# Altium schematic sheet LPCB234 - CHARGER IF.SchDoc
size A3; Address1: Factory 10; Address2: 9-13 Dingley Avenue, Dandeong, VICTORIA 3175, AUSTRALIA; DocumentNumber: 6; Revision: 1; SheetNumber: 6; SheetTotal: 10; Lockie__PCB_SUB_ASSEMBLY: Charger Interface; Lockie__PCB_ASSEMBLY: Main; Lockie__LDL: LPCB234; Lockie__PCB_DESCRIPTION: RM4 Power Node
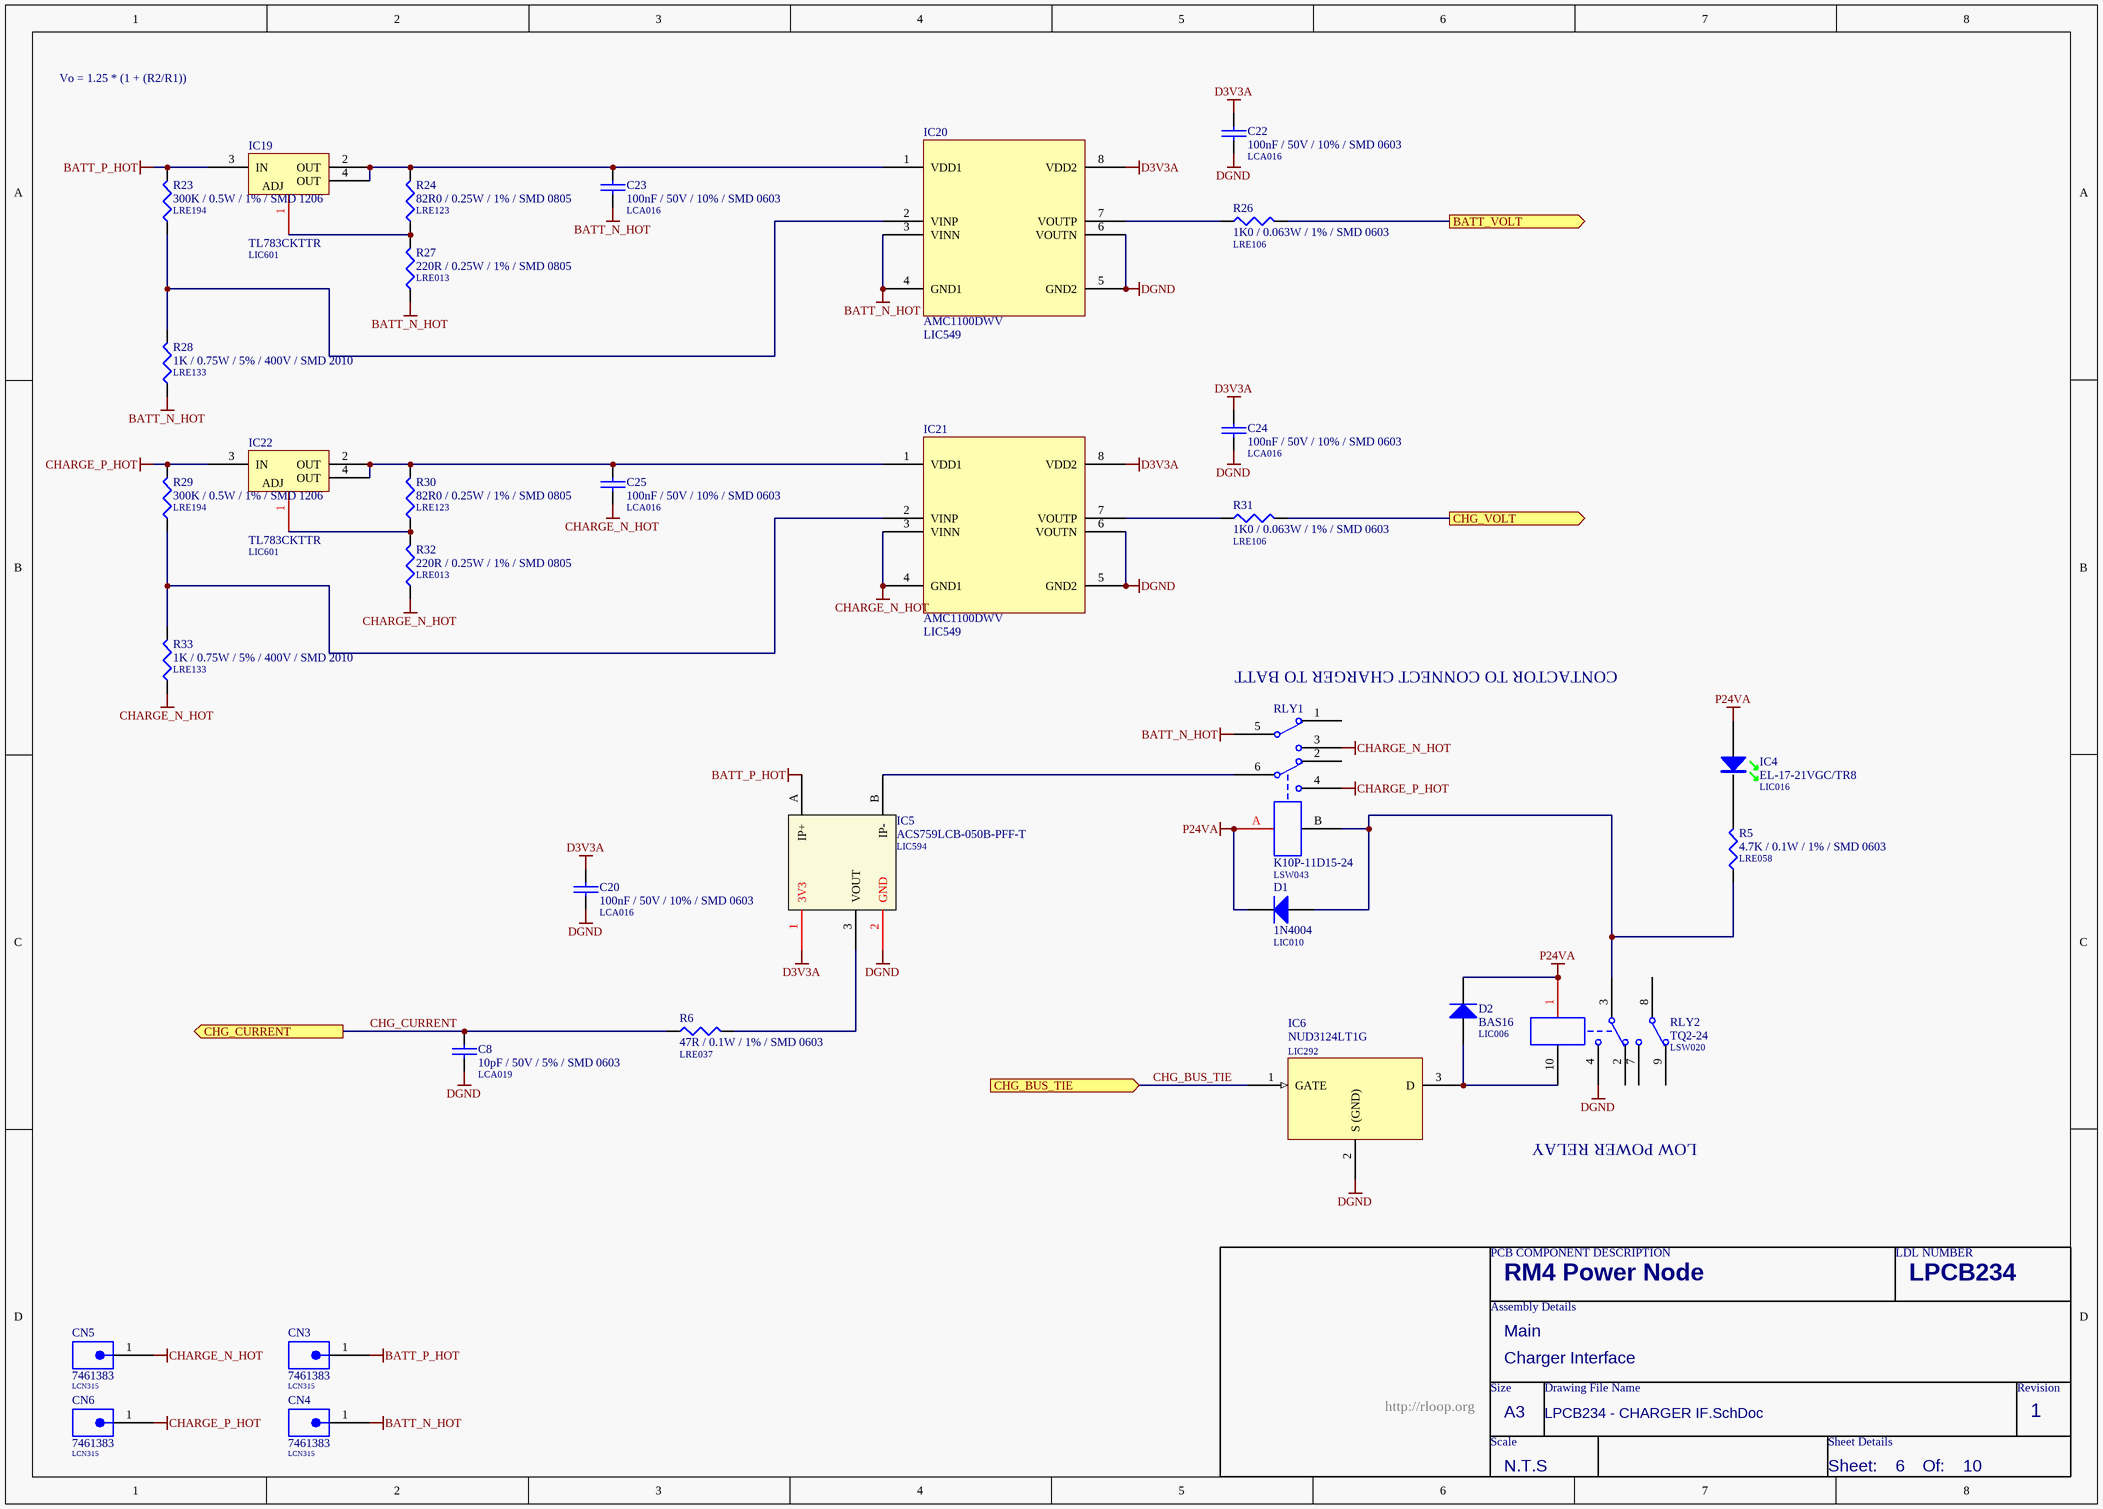
[diagram p0: LPCB234 - CHARGER IF.SchDoc]

## Parts
C8  10pF / 50V / 5% / SMD 0603  LDL_NUMBER: LCA019  [LFP011__CC1608-0603-IPC7351_B]
C20  100nF / 50V / 10% / SMD 0603  LDL_NUMBER: LCA016  [LFP011__CC1608-0603-IPC7351_B]
C22  100nF / 50V / 10% / SMD 0603  LDL_NUMBER: LCA016  [LFP011__CC1608-0603-IPC7351_B]
C23  100nF / 50V / 10% / SMD 0603  LDL_NUMBER: LCA016  [LFP011__CC1608-0603-IPC7351_B]
C24  100nF / 50V / 10% / SMD 0603  LDL_NUMBER: LCA016  [LFP011__CC1608-0603-IPC7351_B]
C25  100nF / 50V / 10% / SMD 0603  LDL_NUMBER: LCA016  [LFP011__CC1608-0603-IPC7351_B]
CN3  7461383  LDL_NUMBER: LCN315  [7461383]
CN4  7461383  LDL_NUMBER: LCN315  [7461383]
CN5  7461383  LDL_NUMBER: LCN315  [7461383]
CN6  7461383  LDL_NUMBER: LCN315  [7461383]
D1  1N4004  LDL_NUMBER: LIC010  [DO-41]
D2  BAS16  LDL_NUMBER: LIC006  [LFP021__SOT23]
IC4  EL-17-21VGC/TR8  LDL_NUMBER: LIC016  [CR2012-0805-LED]
IC5  ACS759LCB-050B-PFF-T  LDL_NUMBER: LIC594  [CB-PFF]
IC6  NUD3124LT1G  LDL_NUMBER: LIC292  [LFP021__SOT23]
IC19  TL783CKTTR  LDL_NUMBER: LIC601  [LFP147__KTT-R-PSFM-G3]
IC20  AMC1100DWV  LDL_NUMBER: LIC549  [LFP116__R-PDSO-G8]
IC21  AMC1100DWV  LDL_NUMBER: LIC549  [LFP116__R-PDSO-G8]
IC22  TL783CKTTR  LDL_NUMBER: LIC601  [LFP147__KTT-R-PSFM-G3]
R5  4.7K / 0.1W / 1% / SMD 0603  LDL_NUMBER: LRE058  [LFP020__CR1608-0603-IPC7351_B]
R6  47R / 0.1W / 1% / SMD 0603  LDL_NUMBER: LRE037  [LFP020__CR1608-0603-IPC7351_B]
R23  300K / 0.5W / 1% / SMD 1206  LDL_NUMBER: LRE194  [LFP107__CR3216-1206]
R24  82R0 / 0.25W / 1% / SMD 0805  LDL_NUMBER: LRE123  [LFP029__CR2012-0805]
R26  1K0 / 0.063W / 1% / SMD 0603  LDL_NUMBER: LRE106  [LFP020__CR1608-0603-IPC7351_B]
R27  220R / 0.25W / 1% / SMD 0805  LDL_NUMBER: LRE013  [LFP029__CR2012-0805]
R28  1K / 0.75W / 5% / 400V / SMD 2010  LDL_NUMBER: LRE133  [LFP060__CR5025-2010]
R29  300K / 0.5W / 1% / SMD 1206  LDL_NUMBER: LRE194  [LFP107__CR3216-1206]
R30  82R0 / 0.25W / 1% / SMD 0805  LDL_NUMBER: LRE123  [LFP029__CR2012-0805]
R31  1K0 / 0.063W / 1% / SMD 0603  LDL_NUMBER: LRE106  [LFP020__CR1608-0603-IPC7351_B]
R32  220R / 0.25W / 1% / SMD 0805  LDL_NUMBER: LRE013  [LFP029__CR2012-0805]
R33  1K / 0.75W / 5% / 400V / SMD 2010  LDL_NUMBER: LRE133  [LFP060__CR5025-2010]
RLY1  K10P-11D15-24  LDL_NUMBER: LSW043  [K10P-11D15-24]
RLY2  TQ2-24  LDL_NUMBER: LSW020  [TQ2]

## Ports
BATT_VOLT (out), CHG_BUS_TIE (in), CHG_CURRENT (out), CHG_VOLT (out)

## Nets
BATT_N_HOT: C23.2 CN4.1 IC20.3(VINN) IC20.4(GND1) R27.1 R28.1 RLY1.5
BATT_P_HOT: CN3.1 IC5.A(IP+) IC19.3(IN) R23.2
CHARGE_N_HOT: C25.2 CN5.1 IC21.3(VINN) IC21.4(GND1) R32.1 R33.1 RLY1.3
CHARGE_P_HOT: CN6.1 IC22.3(IN) R29.2 RLY1.4
D3V3A: C20.1 C22.1 C24.1 IC5.1(3V3) IC20.8(VDD2) IC21.8(VDD2)
DGND: C8.2 C20.2 C22.2 C24.2 IC5.2(GND) IC6.2(S_(GND)) IC20.5(GND2) IC20.6(VOUTN) IC21.5(GND2) IC21.6(VOUTN) RLY2.4
P24VA: D1.K D2.3(K) IC4.A RLY1.A RLY2.1
BATT_VOLT: R26.2 ; port BATT_VOLT
CHG_BUS_TIE: IC6.1(GATE) ; port CHG_BUS_TIE
CHG_CURRENT: C8.1 R6.1 ; port CHG_CURRENT
CHG_VOLT: R31.2 ; port CHG_VOLT
NetC23_1: C23.1 IC19.2(OUT) IC19.4(OUT) IC20.1(VDD1) R24.2
NetC25_1: C25.1 IC21.1(VDD1) IC22.2(OUT) IC22.4(OUT) R30.2
NetD1_A: D1.A R5.1 RLY1.B RLY2.3
NetD2_1: D2.1(A) IC6.3(D) RLY2.10
NetIC4_K: IC4.K R5.2
NetIC5_3: IC5.3(VOUT) R6.2
NetIC5_B: IC5.B(IP-) RLY1.6
NetIC19_1: IC19.1(ADJ) R24.1 R27.2
NetIC20_2: IC20.2(VINP) R23.1 R28.2
NetIC20_7: IC20.7(VOUTP) R26.1
NetIC21_2: IC21.2(VINP) R29.1 R33.2
NetIC21_7: IC21.7(VOUTP) R31.1
NetIC22_1: IC22.1(ADJ) R30.1 R32.2

Not connected (* = marked no-connect by the designer): RLY1 1 2; RLY2 2 7 8 9

## Notes on the sheet
- Vo = 1.25 * (1 + (R2/R1))
- (near RLY1) CONTACTOR TO CONNECT CHARGER TO BATT
- LOW POWER RELAY
- PCB COMPONENT DESCRIPTION
- LDL NUMBER
- Assembly Details
- Size
- Drawing File Name
- Revision
- http://rloop.org
- Scale
- A3
- Sheet Details
- N.T.S
- Sheet:
- Of:

## Library data of the parts
C8 = 10pF / 50V / 5% / SMD 0603: Capacitor, Ceramic Chip, 10pF, 50V, 5%, SMD 0603 [LCA019]; Value: 10p; FMEDA__OPERATING__VOLTAGE_MAX: 3.3; FMEDA__OPERATING__VOLTAGE_MIN: 0; FMEDA__OPERATING__TEMP_MAX: 50; FMEDA__OPERATING__TEMP_MIN: -20; FMEDA__OPERATING__TEMP_TYP: 27; FMEDA__CHANNEL: COM; FMEDA__OPERATING__VOLTAGE_TYP: 3.3; FMEDA__FUNCTION_IN_SYSTEM: *
C20 C22-C25 = 100nF / 50V / 10% / SMD 0603: Capacitor, Ceramic Chip, 100nF (0.1uF), 50V, 5%, SMD 0603 [LCA016]; Value: 100n; FMEDA__OPERATING__VOLTAGE_MIN: 0; FMEDA__OPERATING__VOLTAGE_MAX: 3.3; FMEDA__OPERATING__TEMP_MIN: -20; FMEDA__OPERATING__TEMP_TYP: 27; FMEDA__OPERATING__TEMP_MAX: 50; FMEDA__CHANNEL: COM; FMEDA__FUNCTION_IN_SYSTEM: *; FMEDA__OPERATING__VOLTAGE_TYP: 3.3
CN3-CN6 = 7461383: Terminal, Bush with M5 Shank; FMEDA__CHANNEL: COM; FMEDA__OPERATING__CURRENT_MAX: 0; FMEDA__OPERATING__TEMP_MAX: 50; FMEDA__OPERATING__TEMP_MIN: -20; FMEDA__OPERATING__TEMP_TYP: 27; FMEDA__OPERATING__VOLTAGE_MAX: 16; FMEDA__OPERATING__VOLTAGE_TYP: 12; FMEDA__OPERATING__CURRENT_MIN: 0; FMEDA__OPERATING__CURRENT_TYP: 0; FMEDA__OPERATING__VOLTAGE_MIN: 0
D1 = 1N4004: Diode, General Purpose Rectifier, 1A, PTH [LIC010]; FMEDA__OPERATING__TEMP_MAX: 50; FMEDA__OPERATING__TEMP_MIN: -20; FMEDA__OPERATING__TEMP_TYP: 27; FMEDA__OPERATING__VOLTAGE_MAX: 0; FMEDA__CHANNEL: COM; FMEDA__FUNCTION_IN_SYSTEM: *; FMEDA__OPERATING__VOLTAGE_MIN: 0; FMEDA__OPERATING__VOLTAGE_TYP: 0; FMEDA__OPERATING__CURRENT_MAX: 0; FMEDA__OPERATING__CURRENT_MIN: 0; FMEDA__OPERATING__CURRENT_TYP: 0
D2 = BAS16: Diode, Small Signal, 0.2A, 85V, SMD SOT-23 [LIC006]; FMEDA__OPERATING__CURRENT_MIN: 0; FMEDA__OPERATING__TEMP_MIN: -20; FMEDA__OPERATING__TEMP_TYP: 27; FMEDA__OPERATING__TEMP_MAX: 50; FMEDA__CHANNEL: COM; FMEDA__OPERATING__CURRENT_MAX: 0; FMEDA__OPERATING__VOLTAGE_MIN: 0; FMEDA__OPERATING__VOLTAGE_MAX: 0; FMEDA__FUNCTION_IN_SYSTEM: *; FMEDA__OPERATING__CURRENT_TYP: 0; FMEDA__OPERATING__VOLTAGE_TYP: 0
IC4 = EL-17-21VGC/TR8: LED, SMD, 0805 Green [LIC016]; FMEDA__OPERATING__TEMP_MAX: 50; FMEDA__OPERATING__TEMP_MIN: -20; FMEDA__OPERATING__TEMP_TYP: 27; FMEDA__CHANNEL: COM; FMEDA__FUNCTION_IN_SYSTEM: *
IC5 = ACS759LCB-050B-PFF-T: IC, Hall Effect Current Sensor, PTH; FMEDA__OPERATING__TEMP_MAX: 50; FMEDA__OPERATING__TEMP_MIN: -20; FMEDA__OPERATING__TEMP_TYP: 27; FMEDA__CHANNEL: COM; FMEDA__FUNCTION_IN_SYSTEM: *
IC6 = NUD3124LT1G: IC, Relay Driver, 28V Industrial, SMD SOT23 [LIC292]; FMEDA__OPERATING__TEMP_MIN: -20; FMEDA__OPERATING__TEMP_TYP: 27; FMEDA__OPERATING__TEMP_MAX: 50; FMEDA__OPERATING__VOLTAGE_MIN: 0; FMEDA__OPERATING__VOLTAGE_TYP: 13; FMEDA__OPERATING__VOLTAGE_MAX: 18; FMEDA__OPERATING__POWER_TYP: 0.1; FMEDA__OPERATING__POWER_MAX: 0.15; FMEDA__CHANNEL: COM; FMEDA__FUNCTION_IN_SYSTEM: *; FMEDA__OPERATING__POWER_MIN: 0
IC19 IC22 = TL783CKTTR: IC, High Volt LDO, 0.7A [LIC601]; FMEDA__OPERATING__OUTPUT_CURRENT_MIN: 0; FMEDA__OPERATING__TEMP_MAX: 50; FMEDA__OPERATING__TEMP_MIN: -20; FMEDA__OPERATING__TEMP_TYP: 27; VALUE: 0; Note: Obey Thermal Design Rules; FMEDA__CHANNEL: COM; FMEDA__OPERATING__OUTPUT_CURRENT_TYP: 0; FMEDA__OPERATING__VOLTAGE_MAX: 0; FMEDA__OPERATING__VOLTAGE_MIN: 0; FMEDA__OPERATING__VOLTAGE_TYP: 0; FMEDA__FUNCTION_IN_SYSTEM: *
IC20 IC21 = AMC1100DWV: IC, Isolation Amplifier, SMD SOIC8 [LIC549]
R5 = 4.7K / 0.1W / 1% / SMD 0603: Resistor, Ceramic Chip, 4K7, 0.1W, 1%, SMD 0603 [LRE058]; FMEDA__OPERATING__POWER_MAX: 0; FMEDA__OPERATING__TEMP_MAX: 50; FMEDA__OPERATING__TEMP_MIN: -20; FMEDA__OPERATING__TEMP_TYP: 27; FMEDA__CHANNEL: COM; VALUE: 4.7K; FMEDA__OPERATING__POWER_MIN: 0; FMEDA__OPERATING__VOLTAGE_MAX: 0; FMEDA__OPERATING__VOLTAGE_MIN: 0; FMEDA__OPERATING__VOLTAGE_TYP: 0; FMEDA__FUNCTION_IN_SYSTEM: *
R6 = 47R / 0.1W / 1% / SMD 0603: Resistor, Ceramic Chip, 47R, 0.1W, 1%, SMD 0603 [LRE037]; VALUE: 47; FMEDA__OPERATING__POWER_MAX: 0; FMEDA__OPERATING__TEMP_MAX: 50; FMEDA__OPERATING__TEMP_MIN: -20; FMEDA__OPERATING__TEMP_TYP: 27; FMEDA__CHANNEL: COM; FMEDA__OPERATING__POWER_MIN: 0; FMEDA__OPERATING__VOLTAGE_MAX: 0; FMEDA__OPERATING__VOLTAGE_MIN: 0; FMEDA__OPERATING__VOLTAGE_TYP: 0; FMEDA__FUNCTION_IN_SYSTEM: *
R23 R29 = 300K / 0.5W / 1% / SMD 1206: Resistor, Thick Film, 300K, 0.500W, 200V, 1%, SMD 1206 [LRE194]; FMEDA__OPERATING__POWER_MAX: 0.5; FMEDA__OPERATING__POWER_MIN: 0; FMEDA__OPERATING__VOLTAGE_MAX: 200; FMEDA__OPERATING__TEMP_MAX: 155; FMEDA__OPERATING__TEMP_MIN: -55; FMEDA__OPERATING__TEMP_TYP: 27; FMEDA__CHANNEL: COM; VALUE: 300K; FMEDA__OPERATING__VOLTAGE_MIN: 0; FMEDA__OPERATING__VOLTAGE_TYP: 200; FMEDA__FUNCTION_IN_SYSTEM: *
R24 R30 = 82R0 / 0.25W / 1% / SMD 0805: Resistor, Ceramic Chip, 82R, 0.063W, 1%, SMD 0805 [LRE123]; Value: 82; FMEDA__OPERATING__POWER_MAX: 0; FMEDA__OPERATING__TEMP_MAX: 50; FMEDA__OPERATING__TEMP_MIN: -20; FMEDA__OPERATING__TEMP_TYP: 27; FMEDA__CHANNEL: COM; FMEDA__OPERATING__POWER_MIN: 0; FMEDA__OPERATING__VOLTAGE_MAX: 0; FMEDA__OPERATING__VOLTAGE_MIN: 0; FMEDA__OPERATING__VOLTAGE_TYP: 0
R26 R31 = 1K0 / 0.063W / 1% / SMD 0603: Resistor, Ceramic Chip, 1K0, 0.063W, 1%, SMD 0603 [LRE106]; Value: 1K; FMEDA__OPERATING__POWER_MAX: 0; FMEDA__OPERATING__TEMP_MAX: 50; FMEDA__OPERATING__TEMP_MIN: -20; FMEDA__OPERATING__TEMP_TYP: 27; FMEDA__CHANNEL: COM; FMEDA__OPERATING__POWER_MIN: 0; FMEDA__OPERATING__VOLTAGE_MAX: 0; FMEDA__OPERATING__VOLTAGE_MIN: 0; FMEDA__OPERATING__VOLTAGE_TYP: 0; FMEDA__FUNCTION_IN_SYSTEM: *
R27 R32 = 220R / 0.25W / 1% / SMD 0805: Resistor, Ceramic Chip, 220R, 0.25W, 1%, SMD 0805 [LRE013]; Value: 220; FMEDA__OPERATING__POWER_MAX: 0; FMEDA__OPERATING__TEMP_MAX: 50; FMEDA__OPERATING__TEMP_MIN: -20; FMEDA__OPERATING__TEMP_TYP: 27; FMEDA__CHANNEL: COM; FMEDA__OPERATING__POWER_MIN: 0; FMEDA__OPERATING__VOLTAGE_MAX: 0; FMEDA__OPERATING__VOLTAGE_MIN: 0; FMEDA__OPERATING__VOLTAGE_TYP: 0; FMEDA__FUNCTION_IN_SYSTEM: *
R28 R33 = 1K / 0.75W / 5% / 400V / SMD 2010: Resistor, Thick Film, 1K, 0.75W, 5%, 400V, SMD 2010 [LRE133]; FMEDA__OPERATING__POWER_MAX: 0; FMEDA__OPERATING__TEMP_MAX: 50; FMEDA__OPERATING__TEMP_MIN: -20; FMEDA__OPERATING__TEMP_TYP: 27; FMEDA__CHANNEL: COM; Value: 1K; FMEDA__OPERATING__POWER_MIN: 0; FMEDA__OPERATING__VOLTAGE_MAX: 0; FMEDA__OPERATING__VOLTAGE_MIN: 0; FMEDA__OPERATING__VOLTAGE_TYP: 0; FMEDA__FUNCTION_IN_SYSTEM: *
RLY1 = K10P-11D15-24: Relay, DPDT, 24V, Socket Mount; FMEDA__OPERATING__TEMP_MAX: 50; FMEDA__OPERATING__TEMP_MIN: -20; FMEDA__OPERATING__TEMP_TYP: 27; FMEDA__CHANNEL: COM; Revision: July-2002: Re-released for DXP Platform.; FMEDA__FUNCTION_IN_SYSTEM: *
RLY2 = TQ2-24: Relay, DPDT, Non Latching, 24VDC Coil, 1A Rating, PTH; FMEDA__CHANNEL: COM; FMEDA__OPERATING__TEMP_MAX: 50; FMEDA__OPERATING__TEMP_MIN: -20; FMEDA__OPERATING__TEMP_TYP: 27; Revision: July-2002: Re-released for DXP Platform.